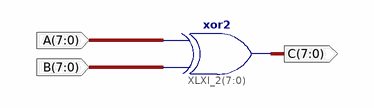
[diagram p0: schematic sheet 1]
// Xilinx ISE schematic xor_state.sch (spartan6) as structural Verilog: 1 symbols, 3 ports
module xor_state (
  input  [7:0] A,
  input  [7:0] B,
  output [7:0] C
);

  assign C = B ^ A;  // xor2 XLXI_2[7..0], 8 bits wide
endmodule
